# Altium project ZLS_Levels.PrjPcb
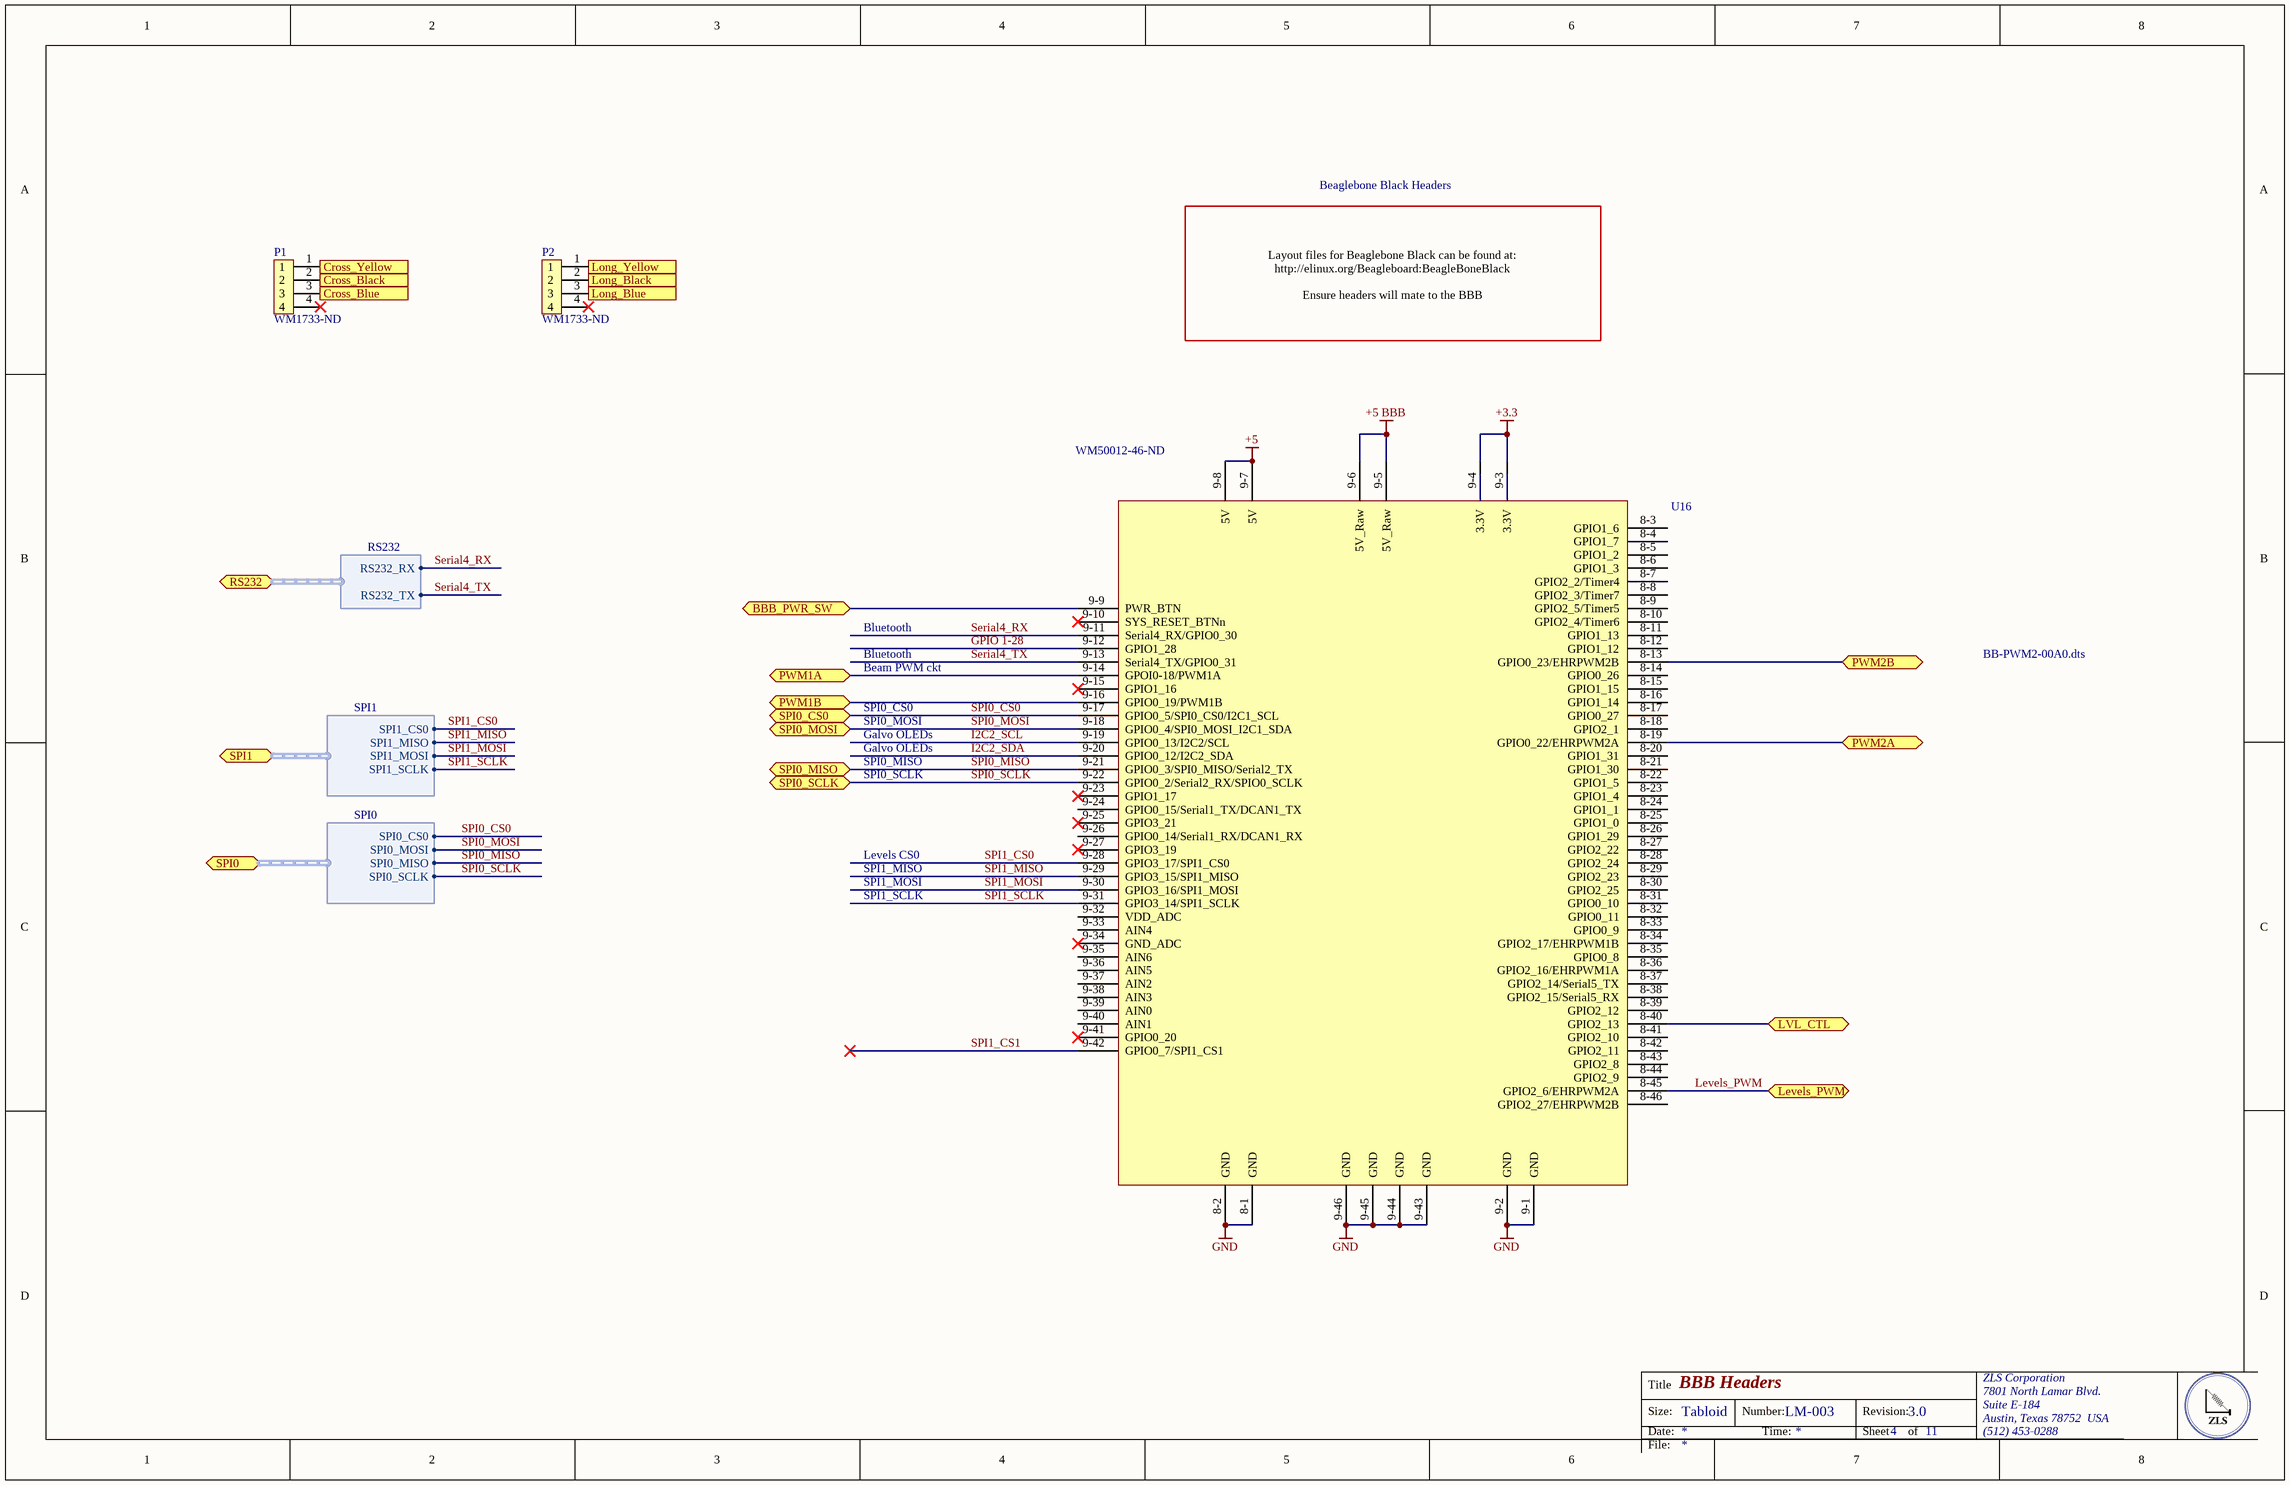
[diagram p0: BBB Headers.SchDoc]
3 sheets, 27 parts. Net scope: flat (ports and power ports of the same name join across sheets).
Board file: ZLS_Levels.PcbDoc
Sheets:
  BBB Headers.SchDoc
  ZLS_Signal_Conditioner.SchDoc
  Ref_DAC.SchDoc

## Sheet BBB Headers.SchDoc: BBB Headers
size Tabloid; DocumentNumber: LM-003; Revision: 3.0; SheetNumber: 4; SheetTotal: 11

### Parts
P1  Supplier Part Number 1: WM1733-ND  [0530470410]  (hidden comment: 0530470410)
P2  Supplier Part Number 1: WM1733-ND  [0530470410]  (hidden comment: 0530470410)
U16  Supplier Part Number 1: WM50012-46-ND  [Beaglebone Black]  (hidden comment: BBB)

### Ports
BBB_PWR_SW, Cross_Black, Cross_Blue, Cross_Yellow, Levels_PWM, Long_Black, Long_Blue, Long_Yellow, LVL_CTL, PWM1A, PWM1B, PWM2A, PWM2B, RS232 (harness RS232), SPI0 (harness SPI0), SPI0_CS0, SPI0_MISO, SPI0_MOSI, SPI0_SCLK, SPI1 (harness SPI1)

### Harnesses
RS232: RS232_RX, RS232_TX
SPI1: SPI1_CS0, SPI1_MISO, SPI1_MOSI, SPI1_SCLK
SPI0: SPI0_CS0, SPI0_MOSI, SPI0_MISO, SPI0_SCLK

### Nets
+3.3: U16.9-3(3.3V) U16.9-4(3.3V)
+5: U16.9-7(5V) U16.9-8(5V)
+5 BBB: U16.9-5(5V_Raw) U16.9-6(5V_Raw)
GND: P1.2 U16.8-1(GND) U16.8-2(GND) U16.9-1(GND) U16.9-2(GND) U16.9-43(GND) U16.9-44(GND) U16.9-45(GND) U16.9-46(GND) ; port Cross_Black
GPIO 1-28: U16.9-12(GPIO1_28)
I2C2_SCL: U16.9-19(GPIO0_13/I2C2/SCL)
I2C2_SDA: U16.9-20(GPIO0_12/I2C2_SDA)
Levels_PWM: U16.8-45(GPIO2_6/EHRPWM2A) ; port Levels_PWM
LVL_CTL: U16.8-40(GPIO2_13) ; port LVL_CTL
Serial4_RX: U16.9-11(Serial4_RX/GPIO0_30) ; port RS232.RS232_RX
Serial4_TX: U16.9-13(Serial4_TX/GPIO0_31) ; port RS232.RS232_TX
SPI0_CS0: U16.9-17(GPIO0_5/SPI0_CS0/I2C1_SCL) ; port SPI0_CS0, port SPI0.SPI0_CS0
SPI0_MISO: U16.9-21(GPIO0_3/SPI0_MISO/Serial2_TX) ; port SPI0_MISO, port SPI0.SPI0_MISO
SPI0_MOSI: U16.9-18(GPIO0_4/SPI0_MOSI_I2C1_SDA) ; port SPI0_MOSI, port SPI0.SPI0_MOSI
SPI0_SCLK: U16.9-22(GPIO0_2/Serial2_RX/SPIO0_SCLK) ; port SPI0_SCLK, port SPI0.SPI0_SCLK
SPI1_CS0: U16.9-28(GPIO3_17/SPI1_CS0) ; port SPI1.SPI1_CS0
SPI1_CS1: U16.9-42(GPIO0_7/SPI1_CS1)
SPI1_MISO: U16.9-29(GPIO3_15/SPI1_MISO) ; port SPI1.SPI1_MISO
SPI1_MOSI: U16.9-30(GPIO3_16/SPI1_MOSI) ; port SPI1.SPI1_MOSI
SPI1_SCLK: U16.9-31(GPIO3_14/SPI1_SCLK) ; port SPI1.SPI1_SCLK
NetC3_1: P2.1 ; port Long_Yellow
NetC8_1: P1.1 ; port Cross_Yellow
NetC12_2: P1.3 ; port Cross_Blue
NetC13_2: P2.3 ; port Long_Blue
NetP2_2: P2.2 ; port Long_Black
NetU16_8-13: U16.8-13(GPIO0_23/EHRPWM2B) ; port PWM2B
NetU16_8-19: U16.8-19(GPIO0_22/EHRPWM2A) ; port PWM2A
NetU16_9-9: U16.9-9(PWR_BTN) ; port BBB_PWR_SW
NetU16_9-14: U16.9-14(GPOI0-18/PWM1A) ; port PWM1A
NetU16_9-16: U16.9-16(GPIO0_19/PWM1B) ; port PWM1B

Not connected (* = marked no-connect by the designer): P1 4*; P2 4*; U16 8-3(GPIO1_6) 8-4(GPIO1_7) 8-5(GPIO1_2) 8-6(GPIO1_3) 8-7(GPIO2_2/Timer4) 8-8(GPIO2_3/Timer7) 8-9(GPIO2_5/Timer5) 8-10(GPIO2_4/Timer6) 8-11(GPIO1_13) 8-12(GPIO1_12) 8-14(GPIO0_26) 8-15(GPIO1_15) 8-16(GPIO1_14) 8-17(GPIO0_27) 8-18(GPIO2_1) 8-20(GPIO1_31) 8-21(GPIO1_30) 8-22(GPIO1_5) 8-23(GPIO1_4) 8-24(GPIO1_1) 8-25(GPIO1_0) 8-26(GPIO1_29) 8-27(GPIO2_22) 8-28(GPIO2_24) 8-29(GPIO2_23) 8-30(GPIO2_25) 8-31(GPIO0_10) 8-32(GPIO0_11) 8-33(GPIO0_9) 8-34(GPIO2_17/EHRPWM1B) 8-35(GPIO0_8) 8-36(GPIO2_16/EHRPWM1A) 8-37(GPIO2_14/Serial5_TX) 8-38(GPIO2_15/Serial5_RX) 8-39(GPIO2_12) 8-41(GPIO2_10) 8-42(GPIO2_11) 8-43(GPIO2_8) 8-44(GPIO2_9) 8-46(GPIO2_27/EHRPWM2B) 9-10(SYS_RESET_BTNn)* 9-15(GPIO1_16)* 9-23(GPIO1_17)* 9-24(GPIO0_15/Serial1_TX/DCAN1_TX) 9-25(GPIO3_21)* 9-26(GPIO0_14/Serial1_RX/DCAN1_RX) 9-27(GPIO3_19)* 9-32(VDD_ADC) 9-33(AIN4) 9-34(GND_ADC)* 9-35(AIN6) 9-36(AIN5) 9-37(AIN2) 9-38(AIN3) 9-39(AIN0) 9-40(AIN1) 9-41(GPIO0_20)*

### Notes on the sheet
- Beaglebone Black Headers
- Layout files for Beaglebone Black can be found at:
  http://elinux.org/Beagleboard:BeagleBoneBlack
  Ensure headers will mate to the BBB
- Bluetooth
- Beam PWM ckt
- BB-PWM2-00A0.dts
- Galvo OLEDs
- SPI0_CS0
- SPI0_MISO
- SPI0_MOSI
- SPI0_SCLK
- SPI1_MISO
- SPI1_SCLK
- Levels CS0
- SPI1_MOSI
- Title
- Size:
- Date:
- Tabloid
- Number:
- Time:
- Revision:
- Sheet
- of
- ZLS Corporation
- 7801 North Lamar Blvd.
- Suite E-184
- Austin, Texas 78752  USA
- (512) 453-0288
- File:

### Library data of the parts
P1 P2 = 0530470410: CONN HEADER VERT 4POS 1.25MM; Manufacturer: Molex; Contact Resistance: 20mR; Number of Positions: 4; Max Voltage Rating (AC): 125V; Connector Type: Blade Pin; Supplier 1: Digi-Key; Manufacturer Part Number: 0530470410; Stock 1: 21727; Pricing 1: 1=0.28, 10=0.261, 100=0.183, 500=0.15688, 1000=0.13073, 5000=0.11205, 10000=0.10458 (USD); Mount: Through Hole; Contact Plating: Tin; Contact Material: Bronze; Color: Natural; Housing Color: White; Housing Material: Nylon; Min Operating Temperature: -40°C; Max Operating Temperature: 85°C; Packaging: Tray; Number of Rows: 1; Termination: Solder; Number of Contacts: 4; Orientation: Straight; Length: 6.75mm; Pitch: 1.25mm; Contact Mating Length: 0.089inch; Depth: 3.2mm; ComponentLink1URL: http://components.arrow.com/part/dataview/2938462S4237926N3303?src-supplier=Arrow; ComponentLink1Description: http://components.arrow.com/part/dataview/2938462S4237926N3303?src-supplier=Arrow
U16 = Beaglebone_Black: Beaglebone Black; Manufacturer: Molex, LLC; Manufacturer Part Number: 0010897462; Connector Type: Header, Breakaway; Pitch - Mating: 0.100" (2.54mm); Style: Board to Board or Cable; Shrouding: Unshrouded; Number of Positions: 46; Number of Positions Loaded: All; Contact Length - Mating: 0.240" (6.10mm); Contact Length - Post: 0.107" (2.71mm); Overall Contact Length: 0.437" (11.10mm); Material Flammability Rating: UL94 V-0; Supplier 1: Digi-Key; RoHS: RoHS Compliant; Category: Connectors, Interconnects; Stock 1: 407; Pricing 1: 1=7.65, 10=7.336, 25=6.698, 50=6.379, 100=6.0601, 250=5.4222, 500=5.10324 (USD); Packaging: Bulk; Part Status: Active; Contact Type: Male Pin; Number of Rows: 2; Row Spacing - Mating: 0.100" (2.54mm); Mounting Type: Through Hole; Termination: Solder; Fastening Type: -; Insulation Height: 0.090" (2.29mm); Contact Shape: Square; Contact Finish - Mating: Gold; Contact Finish Thickness - Mating: 15µin (0.38µm); Contact Finish - Post: Tin; Contact Material: Copper Alloy; Insulation Material: Liquid Crystal Polymer (LCP), Glass Filled; Features: -; Operating Temperature: -; Ingress Protection: -; Insulation Color: Black; Current Rating: -; Voltage Rating: -; Mated Stacking Heights: -; Contact Finish Thickness - Post: 74.8µin (1.90µm); Applications: Automotive, General Purpose, Lighting, Medical, Telecommunications; ComponentLink1URL: http://www.molex.com/pdm_docs/sd/010897041_sd.pdf; ComponentLink1Description: http://www.molex.com/pdm_docs/sd/010897041_sd.pdf

## Sheet ZLS_Signal_Conditioner.SchDoc
size Tabloid
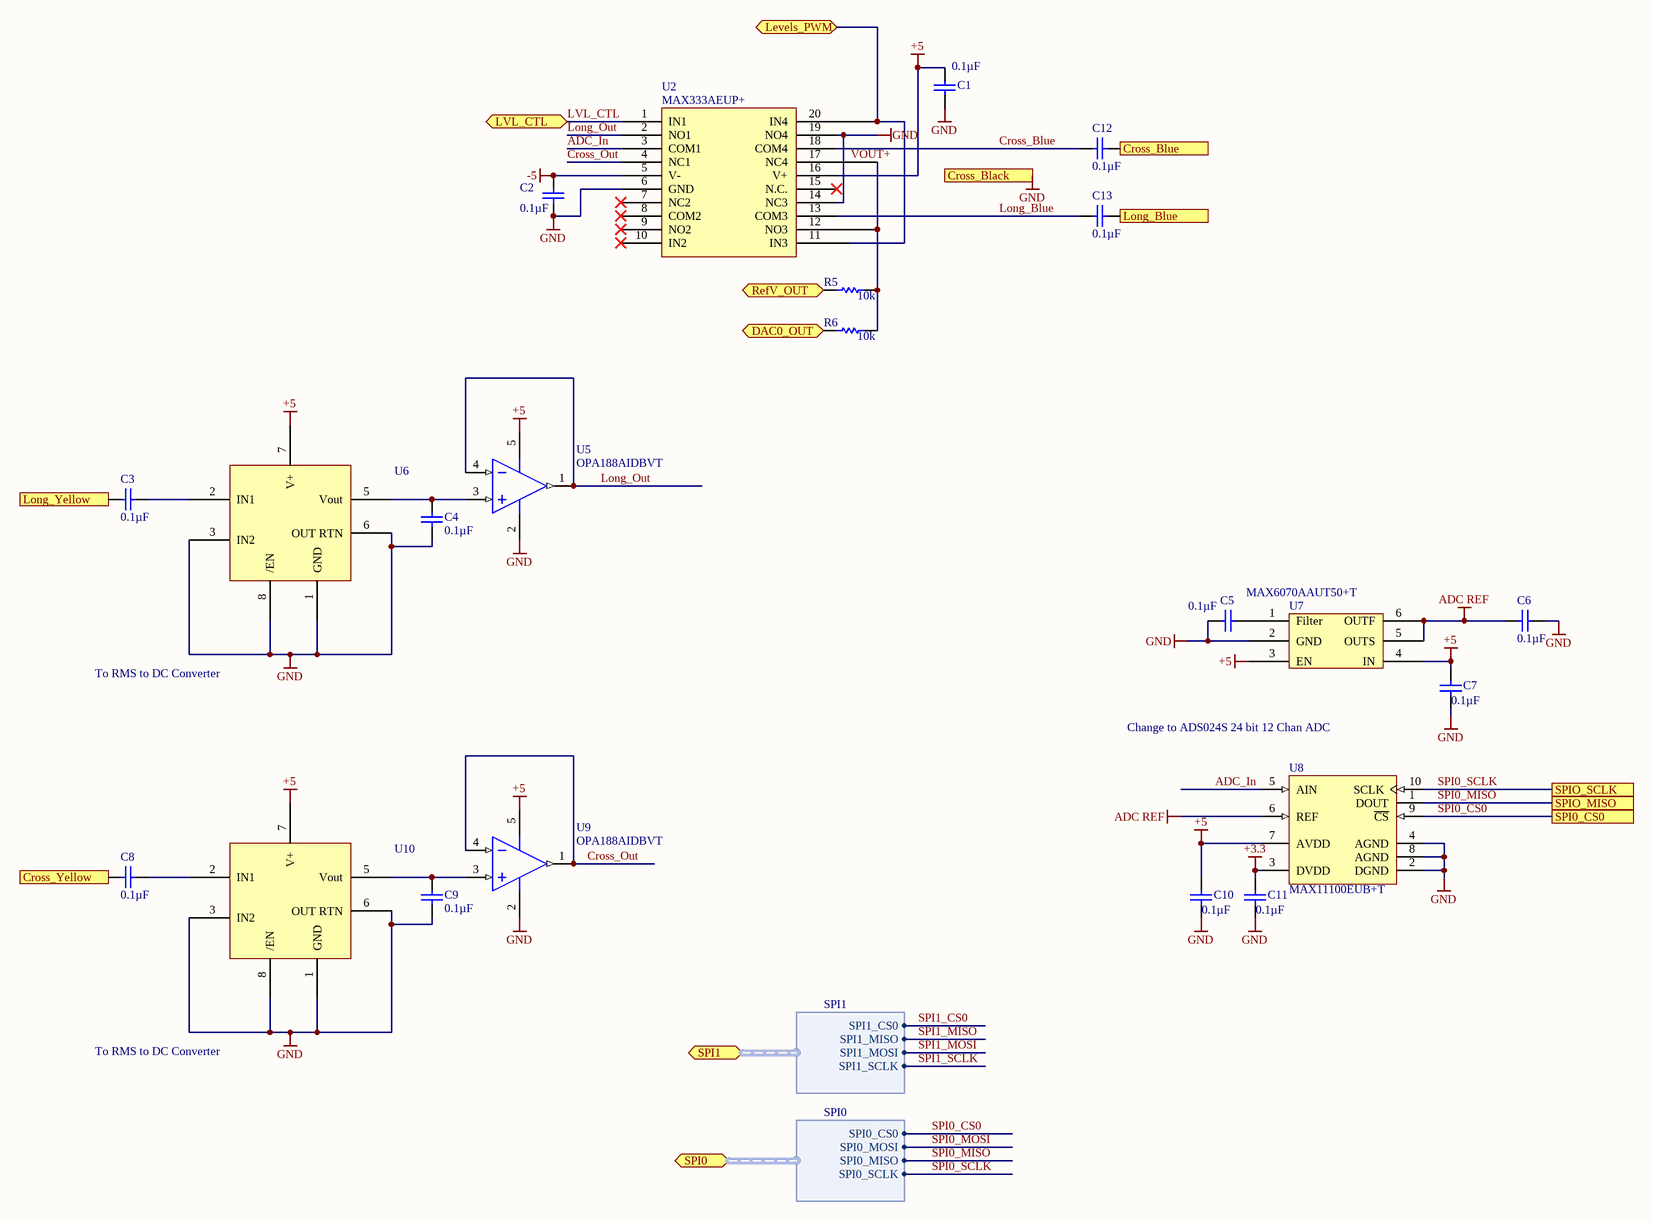
[diagram p1: ZLS_Signal_Conditioner.SchDoc]

### Parts
C1  Capacitance: 0.1µF  [CAPC0805(2012)145_N]  (hidden comment: CAP CER 0.1UF 25V X7R 0805)
C2  Capacitance: 0.1µF  [CAPC0805(2012)145_N]  (hidden comment: CAP CER 0.1UF 25V X7R 0805)
C3  Capacitance: 0.1µF  [CAPC0805(2012)145_N]  (hidden comment: CAP CER 0.1UF 25V X7R 0805)
C4  Capacitance: 0.1µF  [CAPC0805(2012)145_N]  (hidden comment: CAP CER 0.1UF 25V X7R 0805)
C5  Capacitance: 0.1µF  [CAPC0805(2012)145_N]  (hidden comment: CAP CER 0.1UF 25V X7R 0805)
C6  Capacitance: 0.1µF  [CAPC0805(2012)145_N]  (hidden comment: CAP CER 0.1UF 25V X7R 0805)
C7  Capacitance: 0.1µF  [CAPC0805(2012)145_N]  (hidden comment: CAP CER 0.1UF 25V X7R 0805)
C8  Capacitance: 0.1µF  [CAPC0805(2012)145_N]  (hidden comment: CAP CER 0.1UF 25V X7R 0805)
C9  Capacitance: 0.1µF  [CAPC0805(2012)145_N]  (hidden comment: CAP CER 0.1UF 25V X7R 0805)
C10  Capacitance: 0.1µF  [CAPC0805(2012)145_N]  (hidden comment: CAP CER 0.1UF 25V X7R 0805)
C11  Capacitance: 0.1µF  [CAPC0805(2012)145_N]  (hidden comment: CAP CER 0.1UF 25V X7R 0805)
C12  Capacitance: 0.1µF  [CAPC0805(2012)145_N]  (hidden comment: CAP CER 0.1UF 25V X7R 0805)
C13  Capacitance: 0.1µF  [CAPC0805(2012)145_N]  (hidden comment: CAP CER 0.1UF 25V X7R 0805)
R5  10k  [RESC0805(2012)_L]
R6  10k  [RESC0805(2012)_L]
U2  MAX333AEUP+  [TSOP65P640X90-20N]
U5  OPA188AIDBVT  [DBV0005A_L]
U6  LTC1967  [LTC1967]  (value not drawn)
U7  Supplier Part Number 1: MAX6070AAUT50+T  [SOT95P280X445-6N]  (hidden comment: MAX6070AAUT41+T)
U8  MAX11100EUB+T  [U10+2_L]
U9  OPA188AIDBVT  [DBV0005A_L]
U10  LTC1967  [LTC1967]  (value not drawn)

### Ports
Cross_Black, Cross_Blue, Cross_Yellow, DAC0_OUT, Levels_PWM, Long_Blue, Long_Yellow, LVL_CTL, RefV_OUT, SPI0 (harness SPI0), SPI0_CS0, SPI1 (harness SPI1), SPIO_MISO, SPIO_SCLK

### Harnesses
SPI1: SPI1_CS0, SPI1_MISO, SPI1_MOSI, SPI1_SCLK
SPI0: SPI0_CS0, SPI0_MOSI, SPI0_MISO, SPI0_SCLK

### Nets
+3.3: C11.1 U8.3(DVDD)
+5: C1.1 C7.1 C10.1 U2.16(V+) U5.5(V+) U6.7(V+) U7.3(EN) U7.4(IN) U8.7(AVDD) U9.5(V+) U10.7(V+)
-5: C2.1 U2.5(V-)
ADC REF: C6.1 U7.5(OUTS) U7.6(OUTF) U8.6(REF)
GND: C1.2 C2.2 C4.1 C5.1 C6.2 C7.2 C9.1 C10.2 C11.2 U2.6(GND) U2.14(NC3) U2.19(NO4) U5.2(V-) U6.1(GND) U6.3(IN2) U6.6(OUT_RTN) U6.8(/EN) U7.2(GND) U8.2(DGND) U8.4(AGND) U8.8(AGND) U9.2(V-) U10.1(GND) U10.3(IN2) U10.6(OUT_RTN) U10.8(/EN) ; port Cross_Black
ADC_In: U2.3(COM1) U8.5(AIN)
Cross_Blue: C12.1 U2.18(COM4)
Cross_Out: U2.4(NC1) U9.1(OUT) U9.4(IN-)
DAC0_OUT: R6.1 ; port DAC0_OUT
Levels_PWM: U2.11(IN3) U2.20(IN4) ; port Levels_PWM
Long_Blue: C13.1 U2.13(COM3)
Long_Out: U2.2(NO1) U5.1(OUT) U5.4(IN-)
LVL_CTL: U2.1(IN1) ; port LVL_CTL
SPI0_CS0: U8.9(~{CS}) ; port SPI0_CS0, port SPI0.SPI0_CS0
SPI0_MISO: U8.1(DOUT) ; port SPIO_MISO, port SPI0.SPI0_MISO
SPI0_SCLK: U8.10(SCLK) ; port SPIO_SCLK, port SPI0.SPI0_SCLK
VOUT+: R5.2 R6.2 U2.12(NO3) U2.17(NC4)
NetC3_1: C3.1 ; port Long_Yellow
NetC3_2: C3.2 U6.2(IN1)
NetC4_2: C4.2 U5.3(IN+) U6.5(Vout)
NetC5_2: C5.2 U7.1(Filter)
NetC8_1: C8.1 ; port Cross_Yellow
NetC8_2: C8.2 U10.2(IN1)
NetC9_2: C9.2 U9.3(IN+) U10.5(Vout)
NetC12_2: C12.2 ; port Cross_Blue
NetC13_2: C13.2 ; port Long_Blue
NetR5_1: R5.1 ; port RefV_OUT

Not connected (* = marked no-connect by the designer): U2 7(NC2)* 8(COM2)* 9(NO2)* 10(IN2)* 15(N.C.)*; U6 4(NC); U10 4(NC)

### Notes on the sheet
- To RMS to DC Converter
- Change to ADS024S 24 bit 12 Chan ADC
- Title
- Size:
- Date:
- Tabloid
- Number:
- Time:
- Revision:
- Sheet
- of
- ZLS Corporation
- 7801 North Lamar Blvd.
- Suite E-184
- Austin, Texas 78752  USA
- (512) 453-0288
- File:

### Library data of the parts
C1-C13 = CMP-1036-04795-1: Manufacturer: Murata Electronics North America; Manufacturer Part Number: GRM21BR71E104KA01L; Tolerance: ±10%; Supplier 1: Digi-Key; Supplier Part Number 1: 490-1673-6-ND; RoHS: RoHS Compliant; Category: Capacitors; Stock 1: 891652; Pricing 1: 1=0.2, 10=0.145, 100=0.0683, 500=0.04788, 1000=0.03964 (USD); Packaging: Digi-Reel®; Part Status: Active; Voltage - Rated: 25V; Temperature Coefficient: X7R; Operating Temperature: -55°C ~ 125°C; Features: -; Ratings: -; Applications: General Purpose; Mounting Type: Surface Mount, MLCC; Package / Case: 0805 (2012 Metric); Size / Dimension: 0.079" L x 0.049" W (2.00mm x 1.25mm); Height - Seated (Max): -; Thickness (Max): 0.053" (1.35mm); Lead Spacing: -; Lead Style: -; ComponentLink1URL: http://www.murata.com/~/media/webrenewal/support/library/catalog/products/capacitor/mlcc/c02e.ashx; ComponentLink1Description: http://www.murata.com/~/media/webrenewal/support/library/catalog/products/capacitor/mlcc/c02e.ashx
R5 R6 = CMP-1013-00393-1: RES SMD 0 OHM 1% 1/8W 0805
U2 = MAX333CWP+: IC SWITCH QUAD SPDT 20TSSOP; Manufacturer: Maxim Integrated; Multiplexer/Demultiplexer Circuit: 2:1; On-State Resistance (Max): 45 Ohm; Channel-to-Channel Matching (&Delta;Ron): 2 Ohm (Max); Voltage - Supply, Single (V+): 10 V ~ 30 V; Voltage - Supply, Dual (V±): ±4.5 V ~ 20 V; Switch Time (Ton, Toff) (Max): 175ns, 145ns; Charge Injection: 2pC; Channel Capacitance (CS(off), CD(off)): 5pF; Current - Leakage (IS(off)) (Max): 250pA; Crosstalk: -78dB @ 1MHz; Supplier 1: Digi-Key; Supplier Part Number 1: MAX333AEUP+-ND; Manufacturer Part Number: MAX333AEUP+; RoHS: RoHS Compliant; Category: Integrated Circuits (ICs); Stock 1: 1328; Pricing 1: 1=6.77, 10=6.432, 25=6, 50=5.8942 (USD); Packaging: Tube; Part Status: Active; Switch Circuit: SPDT; -3db Bandwidth: -; Operating Temperature: -40°C ~ 85°C (TA); Package / Case: 20-TSSOP (0.173", 4.40mm Width); Supplier Device Package: 20-TSSOP; Base Part Number: MAX333; ComponentLink1URL: https://pdfserv.maximintegrated.com/en/ds/MAX333A.pdf; ComponentLink1Description: https://pdfserv.maximintegrated.com/en/ds/MAX333A.pdf
U5 U9 = CMP-0809-00006-2: Precision, Low Noise, Rail-to-Rail Output, Zero-Drift Operational Amplifier, 4 to 36 V, -40 to 125 degC, 5-pin SOT23 (DBV5), Green (RoHS & no Sb/Br); Manufacturer: Texas Instruments; Iq per channel(Max)(mA): 0.51; Total Supply Voltage(Max)(+5V is 5, +/-5V is 10): 36; GBW(Typ)(MHz): 2; SubFamily: Zero Drift Precision Amplifier; Rating: Catalog; CMRR(Min)(dB): 120; Number of Channels: 1; Slew Rate(Typ)(V/us): 0.8; Total Supply Voltage(Min)(+5V is 5, +/-5V is 10): 4; Offset Drift(Typ)(uV/C): 0.03; PackageDescription: 5-Pin Plastic Small Outline, Body 1.6 x 2.9 mm, Pitch 0.95 mm; PackageReference: DBV0005A; ComponentLink3Description: Package Specification; ComponentLink3URL: http://www.ti.com/litv/pdf/mpds018i; Mounting Technology: Surface Mount; ComponentLink2URL: http://www.ti.com/lit/ds/symlink/opa188.pdf; Code_JEDEC: MO-178; PackageVersion: 4073253-4/K, 03/2006; ComponentLink2Description: Datasheet; DatasheetVersion: SBOS642A; ComponentLink1URL: http://www.ti.com/; ComponentLink1Description: Manufacturer URL; Eco-Plan: Green (RoHS & no Sb/Br); PartNumber: OPA188AIDBVT
U6 U10 = LTC1967: IC CONVERTER RMS-DC PREC 9MSOP
U7 = MAX6070AAUT41+T: IC VREF SERIES 5V SOT23-6; Manufacturer: Maxim; Description: Voltage References Filtered 5V .04% Accuracy VR; Tolerance: 0.04%; Number of Channels: 1; Max Input Voltage: 5.5V; Min Input Voltage: 2.7V; Temperature Coefficient: 6ppm/°C; Quiescent Current: 250uA; Output Current: 10mA; Operating Supply Current: 330uA; Output Type: Fixed; Supplier 1: Avnet; Manufacturer Part Number: MAX6070AAUT50+T; Stock 1: 2500; Pricing 1: 2500=1.69, 5000=1.69, 10000=1.59, 15000=1.59, 25000=1.49 (USD); Mount: Surface Mount; Case/Package: SOT-23-6; Min Operating Temperature: -40°C; Max Operating Temperature: 125°C; Package Quantity: 2500; Packaging: Tape and Reel; Output Voltage: 5V; Min Output Voltage: 5V; Reference Type: Series; ComponentLink1URL: http://www.mouser.com/ds/2/256/MAX6070-MAX6071-217862.pdf?src-supplier=Mouser; ComponentLink1Description: http://www.mouser.com/ds/2/256/MAX6070-MAX6071-217862.pdf?src-supplier=Mouser; ComponentLink2URL: https://media.digikey.com/pdf/Data%20Sheets/Maxim%20PDFs/PartNumberBreakdown_ds.pdf?src-supplier=Digi-Key; ComponentLink2Description: https://media.digikey.com/pdf/Data%20Sheets/Maxim%20PDFs/PartNumberBreakdown_ds.pdf?src-supplier=Digi-Key
U8 = CMP-0249-00017-1: 16-Bit, +5V, 200ksps ADC with 10uA Shutdown, 10-Pin uMAX, -40°C to +85°C, Pb-Free, Tape and Reel; DatasheetVersion: Rev 1, Jan-2012; ComponentLink3URL: http://pdfserv.maxim-ic.com/package_dwgs/21-0061.PDF; PackageReference: U10+2; ComponentLink2URL: http://datasheets.maxim-ic.com/en/ds/MAX11100.pdf; PackageVersion: revL, 2008; ComponentLink1Description: Manufacturer URL; Code_JEDEC: MO-187-BA; ComponentLink1URL: http://www.maxim-ic.com; ComponentLink3Description: Package Specification; PackageDescription: 10-Pin Micro-MAX Thin Shrink Small Outline (uSOP), 3 x 3 x 0.85 mm Body, 0.5 mm Pitch, Pb-Free; ComponentLink2Description: Datasheet

## Sheet Ref_DAC.SchDoc
size OrCAD A
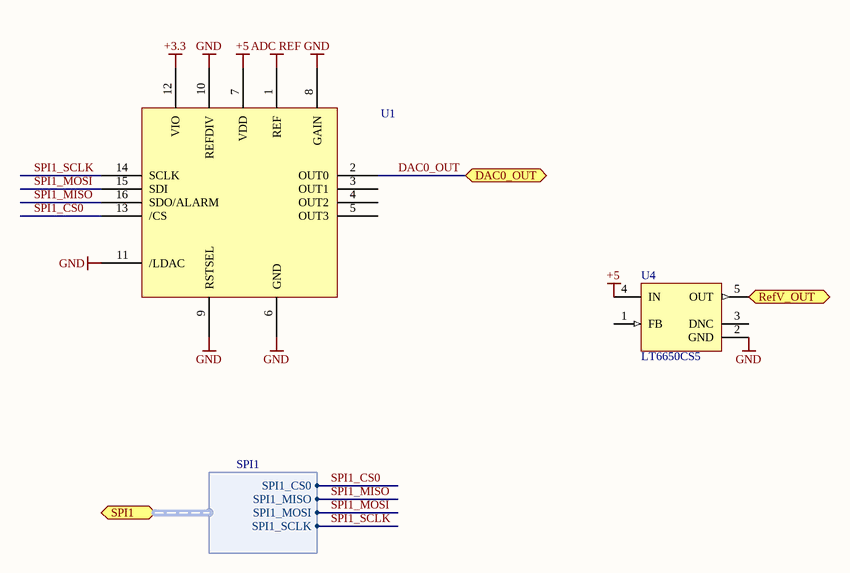
[diagram p2: Ref_DAC.SchDoc]

### Parts
U1  DAC80504  [DAC80504]  (value not drawn)
U4  LT6650CS5  [LT-S5-5-TSOT-23_L]

### Ports
DAC0_OUT, RefV_OUT, SPI1 (harness SPI1)

### Harnesses
SPI1: SPI1_CS0, SPI1_MISO, SPI1_MOSI, SPI1_SCLK

### Nets
+3.3: U1.12(VIO)
+5: U1.7(VDD) U4.4(IN)
ADC REF: U1.1(REF)
GND: U1.6(GND) U1.8(GAIN) U1.9(RSTSEL) U1.10(REFDIV) U1.11(/LDAC) U4.2(GND)
DAC0_OUT: U1.2(OUT0) ; port DAC0_OUT
SPI1_CS0: U1.13(/CS) ; port SPI1.SPI1_CS0
SPI1_MISO: U1.16(SDO/ALARM) ; port SPI1.SPI1_MISO
SPI1_MOSI: U1.15(SDI) ; port SPI1.SPI1_MOSI
SPI1_SCLK: U1.14(SCLK) ; port SPI1.SPI1_SCLK
NetR5_1: U4.5(OUT) ; port RefV_OUT

Not connected (* = marked no-connect by the designer): U1 3(OUT1) 4(OUT2) 5(OUT3); U4 1(FB) 3(DNC)

### Notes on the sheet
- Title
- Size:
- Date:
- Orcad A
- Number:
- Time:
- Revision:
- Sheet
- of
- ZLS Corporation
- 7801 North Lamar Blvd.
- Suite E-184
- Austin, Texas 78752  USA
- (512) 453-0288
- File:

### Library data of the parts
U4 = CMP-1567-00009-1: Micropower, 400 mV Reference with Rail-to-Rail Buffer Amplifier, 1.4 to 18 V, 0 to 70 degC, 5-Pin SOT-23 (S5); VIN Min: 1.4 V; VIN Max: 18 V; PackageVersion: Rev. B, 06/2010; Code_JEDEC: MO-193; ComponentLink3Description: Package Specification; ComponentLink3URL: http://cds.linear.com/docs/en/packaging/SOT_5_05-08-1635.pdf; ComponentLink2Description: Datasheet; PartNumber: LT6650CS5; Temperature Max: 70 degC; ComponentLink1URL: http://www.linear.com/; Temperature Min: 0 degC; PackageDescription: 5-Pin Plastic Thin Small Out-Line Transistor, Body 1.63 x 2.90 mm, Pitch 0.95 mm; ComponentLink2URL: http://cds.linear.com/docs/en/datasheet/6650fa.pdf; Mounting Technology: Surface Mount; ComponentLink1Description: Manufacturer URL

## Nets that join several sheets
+3.3: BBB Headers (U16.9-3 U16.9-4), ZLS_Signal_Conditioner (C11.1 U8.3), Ref_DAC (U1.12)
+5: BBB Headers (U16.9-7 U16.9-8), ZLS_Signal_Conditioner (11 pins), Ref_DAC (U1.7 U4.4)
ADC REF: ZLS_Signal_Conditioner (C6.1 U7.5 U7.6 U8.6), Ref_DAC (U1.1)
GND: BBB Headers (9 pins), ZLS_Signal_Conditioner (26 pins), Ref_DAC (6 pins)
DAC0_OUT: ZLS_Signal_Conditioner (R6.1), Ref_DAC (U1.2)
Levels_PWM: BBB Headers (U16.8-45), ZLS_Signal_Conditioner (U2.11 U2.20)
LVL_CTL: BBB Headers (U16.8-40), ZLS_Signal_Conditioner (U2.1)
NetC3_1: BBB Headers (P2.1), ZLS_Signal_Conditioner (C3.1)
NetC8_1: BBB Headers (P1.1), ZLS_Signal_Conditioner (C8.1)
NetC12_2: BBB Headers (P1.3), ZLS_Signal_Conditioner (C12.2)
NetC13_2: BBB Headers (P2.3), ZLS_Signal_Conditioner (C13.2)
NetR5_1: ZLS_Signal_Conditioner (R5.1), Ref_DAC (U4.5)
SPI0_CS0: BBB Headers (U16.9-17), ZLS_Signal_Conditioner (U8.9)
SPI0_MISO: BBB Headers (U16.9-21), ZLS_Signal_Conditioner (U8.1)
SPI0_SCLK: BBB Headers (U16.9-22), ZLS_Signal_Conditioner (U8.10)
SPI1_CS0: BBB Headers (U16.9-28), Ref_DAC (U1.13)
SPI1_MISO: BBB Headers (U16.9-29), Ref_DAC (U1.16)
SPI1_MOSI: BBB Headers (U16.9-30), Ref_DAC (U1.15)
SPI1_SCLK: BBB Headers (U16.9-31), Ref_DAC (U1.14)